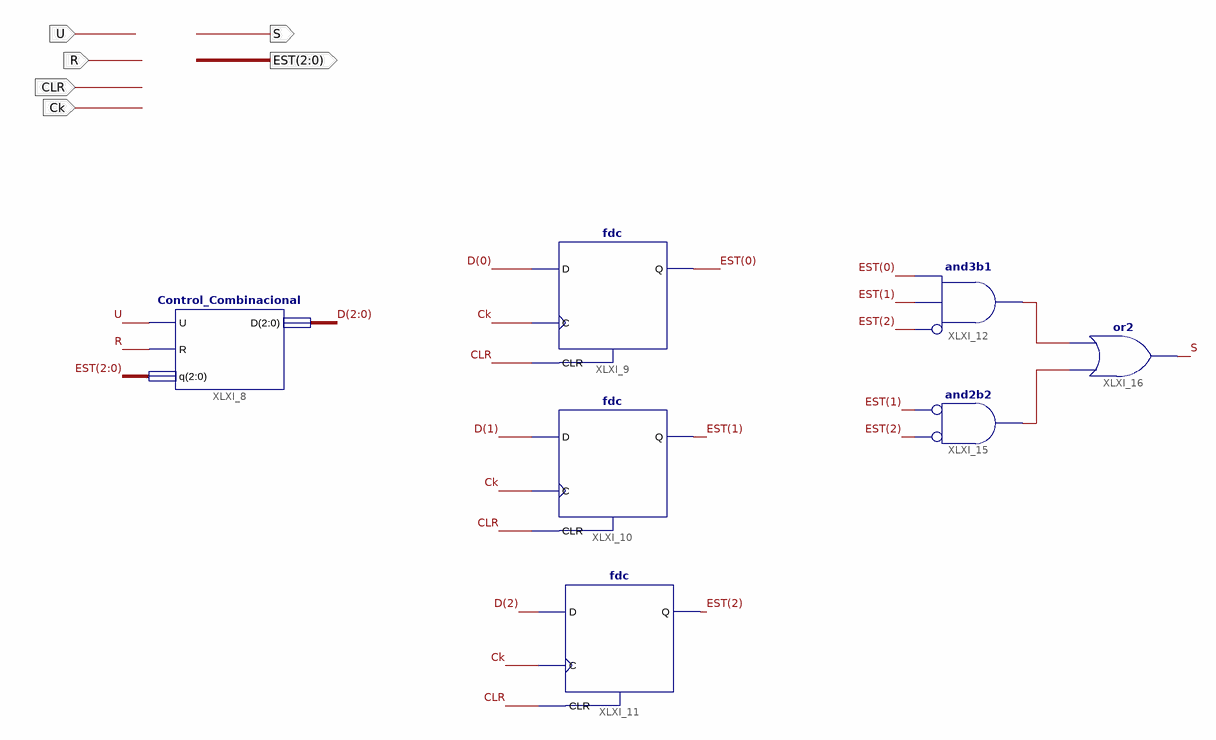
[diagram p0: schematic sheet 1]
// Xilinx ISE schematic Control.sch (spartan6) as structural Verilog: 7 symbols, 6 ports
module Control (
  input  Ck,
  input  CLR,
  input  R,
  input  U,
  output S,
  output [2:0] EST
);

  wire XLXN_42, XLXN_44;
  wire [2:0] D;

  Control_Combinacional XLXI_8 (.D(D), .q(EST), .R(R), .U(U));
  fdc XLXI_9 (.C(Ck), .CLR(CLR), .D(D[0]), .Q(EST[0]));
  fdc XLXI_10 (.C(Ck), .CLR(CLR), .D(D[1]), .Q(EST[1]));
  fdc XLXI_11 (.C(Ck), .CLR(CLR), .D(D[2]), .Q(EST[2]));
  and XLXI_12 (XLXN_42, ~EST[2], EST[1], EST[0]);  // and3b1
  and XLXI_15 (XLXN_44, ~EST[2], ~EST[1]);  // and2b2
  or XLXI_16 (S, XLXN_44, XLXN_42);
endmodule
